# EAGLE design scheme (EAGLE 5.10)
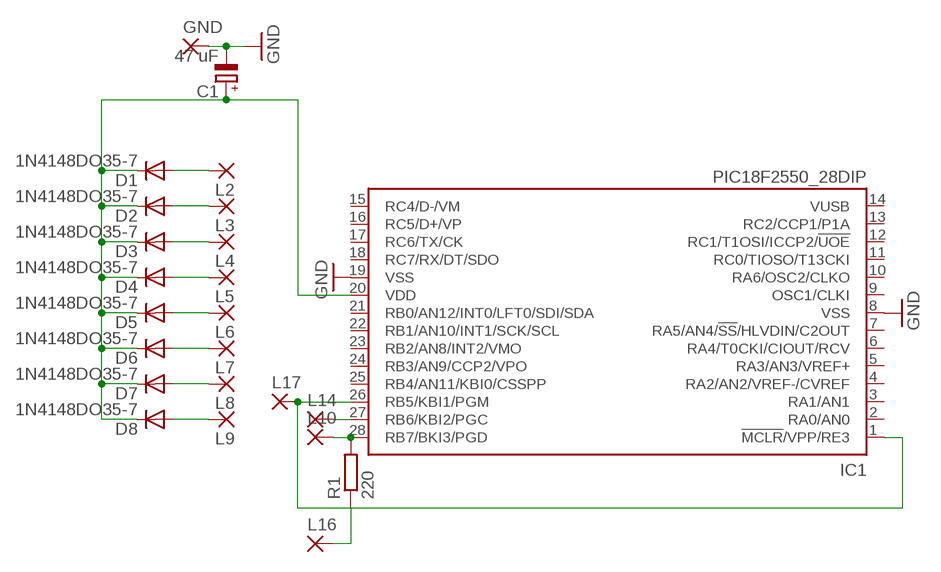
[diagram p0: schematic, sheet 1]

## Parts
C1  47 uF  CPOL-EUE2,5-6E  [E2,5-6E]
D1  1N4148DO35-7  [DO35-7]
D2  1N4148DO35-7  [DO35-7]
D3  1N4148DO35-7  [DO35-7]
D4  1N4148DO35-7  [DO35-7]
D5  1N4148DO35-7  [DO35-7]
D6  1N4148DO35-7  [DO35-7]
D7  1N4148DO35-7  [DO35-7]
D8  1N4148DO35-7  [DO35-7]
GND  2,54/0,8  [2,54/0,8]
IC1  PIC18F2550_28DIP  [DIL28-3]
L2  2,54/0,8  [2,54/0,8]
L3  2,54/0,8  [2,54/0,8]
L4  2,54/0,8  [2,54/0,8]
L5  2,54/0,8  [2,54/0,8]
L6  2,54/0,8  [2,54/0,8]
L7  2,54/0,8  [2,54/0,8]
L8  2,54/0,8  [2,54/0,8]
L9  2,54/0,8  [2,54/0,8]
L10  2,54/0,8  [2,54/0,8]
L14  2,54/0,8  [2,54/0,8]
L16  2,54/0,8  [2,54/0,8]
L17  2,54/0,8  [2,54/0,8]
R1  220  R-EU_0207/7  [0207/7]

## Nets
GND: C1.- GND.1(P) IC1.8(VSS) IC1.19(VSS)
N$1: D1.A L2.1(P)
N$2: D2.A L3.1(P)
N$3: D3.A L4.1(P)
N$4: D4.A L5.1(P)
N$5: D5.A L6.1(P)
N$6: D6.A L7.1(P)
N$7: D7.A L8.1(P)
N$8: D8.A L9.1(P)
N$9: C1.+ D1.C D2.C D3.C D4.C D5.C D6.C D7.C D8.C IC1.20(VDD)
N$11: IC1.1(!MCLR!/VPP/RE3) IC1.26(RB5/KBI1/PGM) L17.1(P)
N$12: IC1.27(RB6/KBI2/PGC) L14.1(P)
N$13: IC1.28(RB7/BKI3/PGD) L10.1(P) R1.2
N$14: L16.1(P) R1.1
Unconnected: IC1.2(RA0/AN0) IC1.3(RA1/AN1) IC1.4(RA2/AN2/VREF-/CVREF) IC1.5(RA3/AN3/VREF+) IC1.6(RA4/T0CKI/CIOUT/RCV) IC1.7(RA5/AN4/!SS!/HLVDIN/C2OUT) IC1.9(OSC1/CLKI) IC1.10(RA6/OSC2/CLKO) IC1.11(RC0/TIOSO/T13CKI) IC1.12(RC1/T1OSI/ICCP2/!UOE) IC1.13(RC2/CCP1/P1A) IC1.14(VUSB) IC1.15(RC4/D-/VM) IC1.16(RC5/D+/VP) IC1.17(RC6/TX/CK) IC1.18(RC7/RX/DT/SDO) IC1.21(RB0/AN12/INT0/LFT0/SDI/SDA) IC1.22(RB1/AN10/INT1/SCK/SCL) IC1.23(RB2/AN8/INT2/VMO) IC1.24(RB3/AN9/CCP2/VPO) IC1.25(RB4/AN11/KBI0/CSSPP)

## Library data of the parts
C1 = rcl:CPOL-EU: POLARIZED CAPACITOR, European symbol
D1-D8 = diode:1N4148: DIODE high speed (Philips)
GND L2-L10 L14 L16 L17 = wirepad:2,54/0,8: THROUGH-HOLE PAD
IC1 = microchip:PIC18F2*_28: USB Microcontrollers with nanoWatt Technology High-Performance, Enhanced Flash, 28/40/44-Pin, Source: http://ww1.microchip.com/downloads/en/devicedoc/39632c.pdf
R1 = rcl:R-EU_: RESISTOR, European symbol

## Board
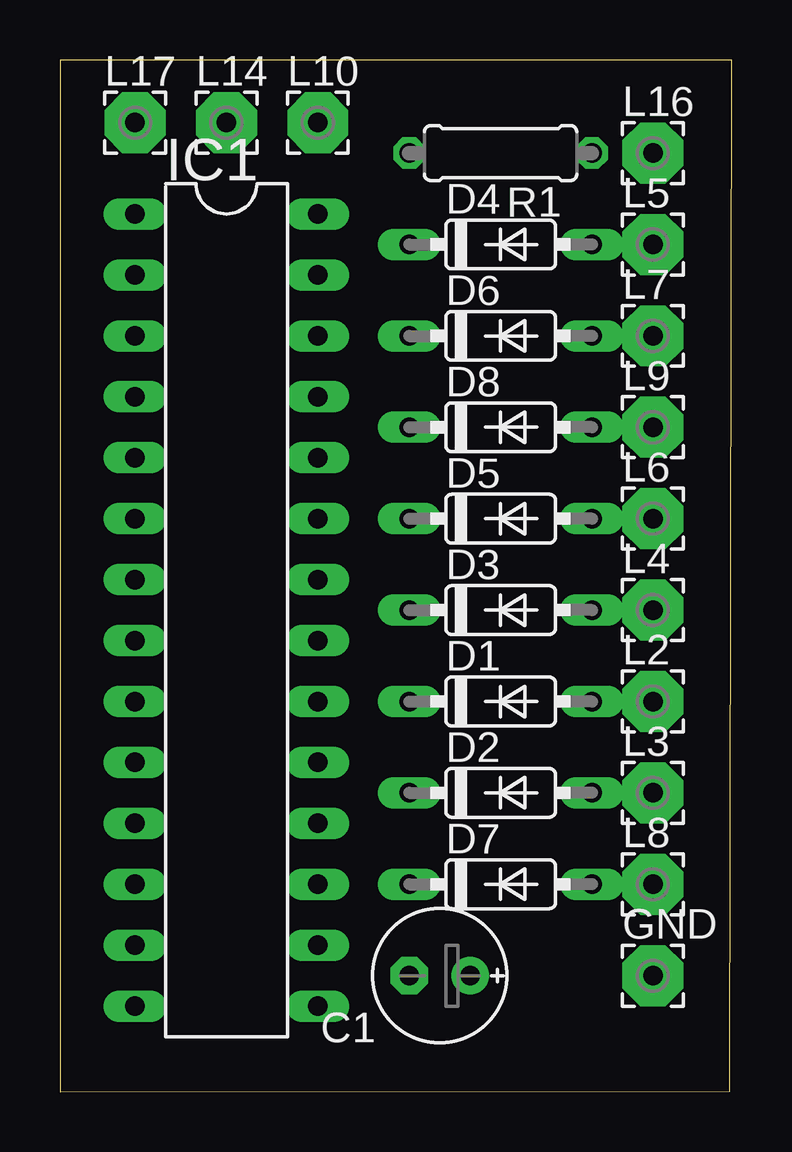
[diagram p1: board, top side]
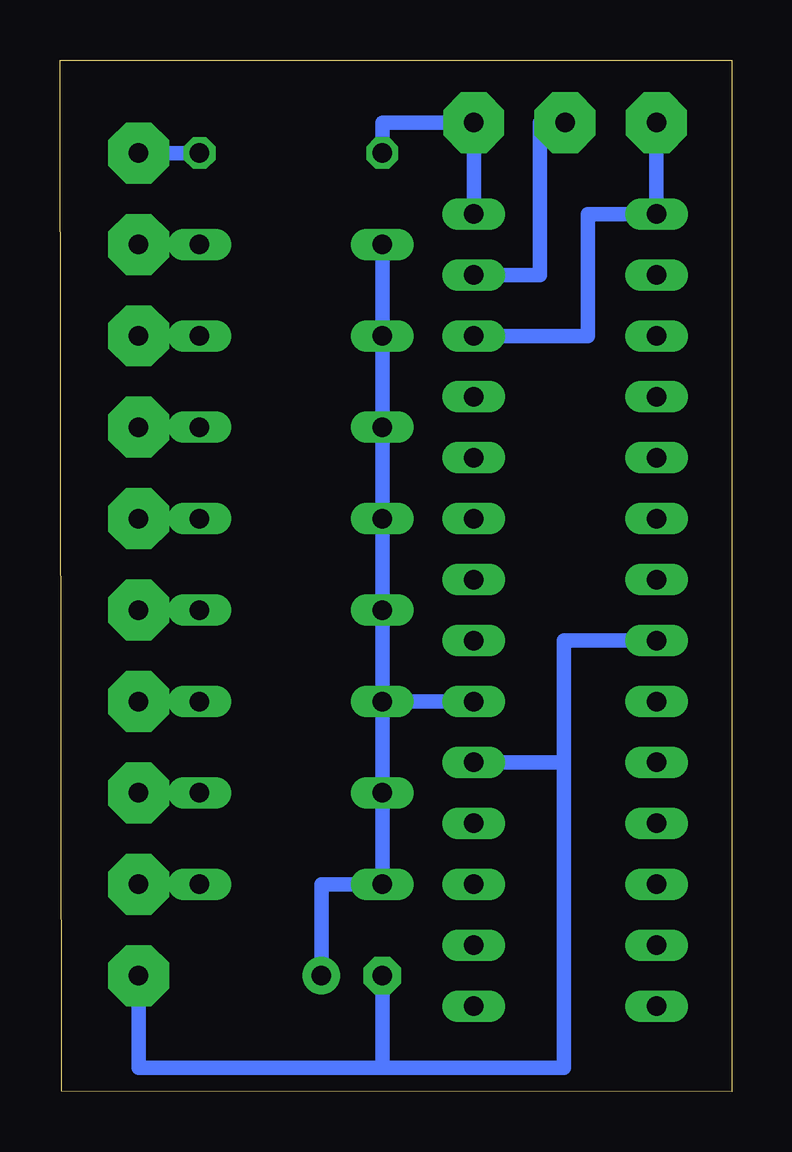
[diagram p2: board, bottom side, seen from below]

Size 28 x 43 mm. Coordinates in mm from the lower left corner, seen from the top.
Outline: 0,0 27.93,0.02 28,43 0,43 0,0
Copper layers (1*16): Top 0.035mm / dielectric 1.5mm / Bottom 0.035mm
Design rules "default": minimum track width 10mil, minimum drill 24mil, track to track 8mil, track to pad 8mil, pad to pad 8mil, via to via 8mil, smd to smd 8mil, copper to edge 40mil, drill to drill 8mil, minimum pad ring 10mil, minimum via ring 8mil, stop-mask expansion 4mil, vias tented up to drill 0mil, thermal gap 10mil

### Footprints (pad centres in the part's own frame; a part is rotated, then mirrored left to right if it is on the bottom)
E2,5-6E = drill 0.813 pad 1.575 round: + -1.27,0 | drill 0.813 pad 1.575 octagon: - 1.27,0
DO35-7 = drill 0.813 long: A 3.81,0; C -3.81,0
2,54/0,8 = drill 0.813 pad 2.54 octagon: 1 0,0
DIL28-3 = drill 0.813 long: 1 -16.51,-3.81; 2 -13.97,-3.81; 3 -11.43,-3.81; 4 -8.89,-3.81; 5 -6.35,-3.81; 6 -3.81,-3.81; 7 -1.27,-3.81; 8 1.27,-3.81; 9 3.81,-3.81; 10 6.35,-3.81; 11 8.89,-3.81; 12 11.43,-3.81; 13 13.97,-3.81; 14 16.51,-3.81; 15 16.51,3.81; 16 13.97,3.81; 17 11.43,3.81; 18 8.89,3.81; 19 6.35,3.81; 20 3.81,3.81; 21 1.27,3.81; 22 -1.27,3.81; 23 -3.81,3.81; 24 -6.35,3.81; 25 -8.89,3.81; 26 -11.43,3.81; 27 -13.97,3.81; 28 -16.51,3.81
0207/7 = drill 0.813 octagon: 1 -3.81,0; 2 3.81,0

### Placement (x,y rotation side)
C1  15.83,4.83 180 top
D1  18.37,16.26 0 top
D2  18.37,12.45 0 top
D3  18.37,20.07 0 top
D4  18.37,35.31 0 top
D5  18.37,23.88 0 top
D6  18.37,31.5 0 top
D7  18.37,8.64 0 top
D8  18.37,27.69 0 top
GND  24.72,4.83 0 top
IC1  6.94,20.07 270 top
L2  24.72,16.26 0 top
L3  24.72,12.45 0 top
L4  24.72,20.07 0 top
L5  24.72,35.31 0 top
L6  24.72,23.88 0 top
L7  24.72,31.5 0 top
L8  24.72,8.64 0 top
L9  24.72,27.69 0 top
L10  10.75,40.39 0 top
L14  6.94,40.39 0 top
L16  24.72,39.12 0 top
L17  3.13,40.39 0 top
R1  18.37,39.12 180 top

### Tracks (layer width: path | path; a pad name or v marks a point on that pad's centre or on a via)
GND
  Bottom 0.61: 14.56,3.44 C1.- 14.56,1 | IC1.8 7,18.8 7,13.72 | 7,13.72 IC1.19 | 7,13.72 7,1 14.56,1 | 14.56,1 24.72,1 GND.1
N$1
  Bottom 0.61: D1.A L2.1
N$2
  Bottom 0.61: D2.A L3.1
N$3
  Bottom 0.61: D3.A L4.1
N$4
  Bottom 0.61: D4.A L5.1
N$5
  Bottom 0.61: D5.A L6.1
N$6
  Bottom 0.61: D6.A L7.1
N$7
  Bottom 0.61: D7.A L8.1
N$8
  Bottom 0.61: D8.A L9.1
N$9
  Bottom 0.61: D1.C D2.C D7.C 17.1,8.64 C1.+ | D1.C D3.C D5.C D8.C D6.C D4.C | D1.C IC1.20
N$11
  Bottom 0.61: L17.1 IC1.1 6,36.58 6,31.5 IC1.26
N$12
  Bottom 0.61: L14.1 8,40.39 8,34.04 IC1.27
N$13
  Bottom 0.61: IC1.28 L10.1 14.56,40.39 R1.2
N$14
  Bottom 0.61: R1.1 L16.1